# Altium schematic sheet MainBoard.SchDoc
size A3; SheetNumber: 2
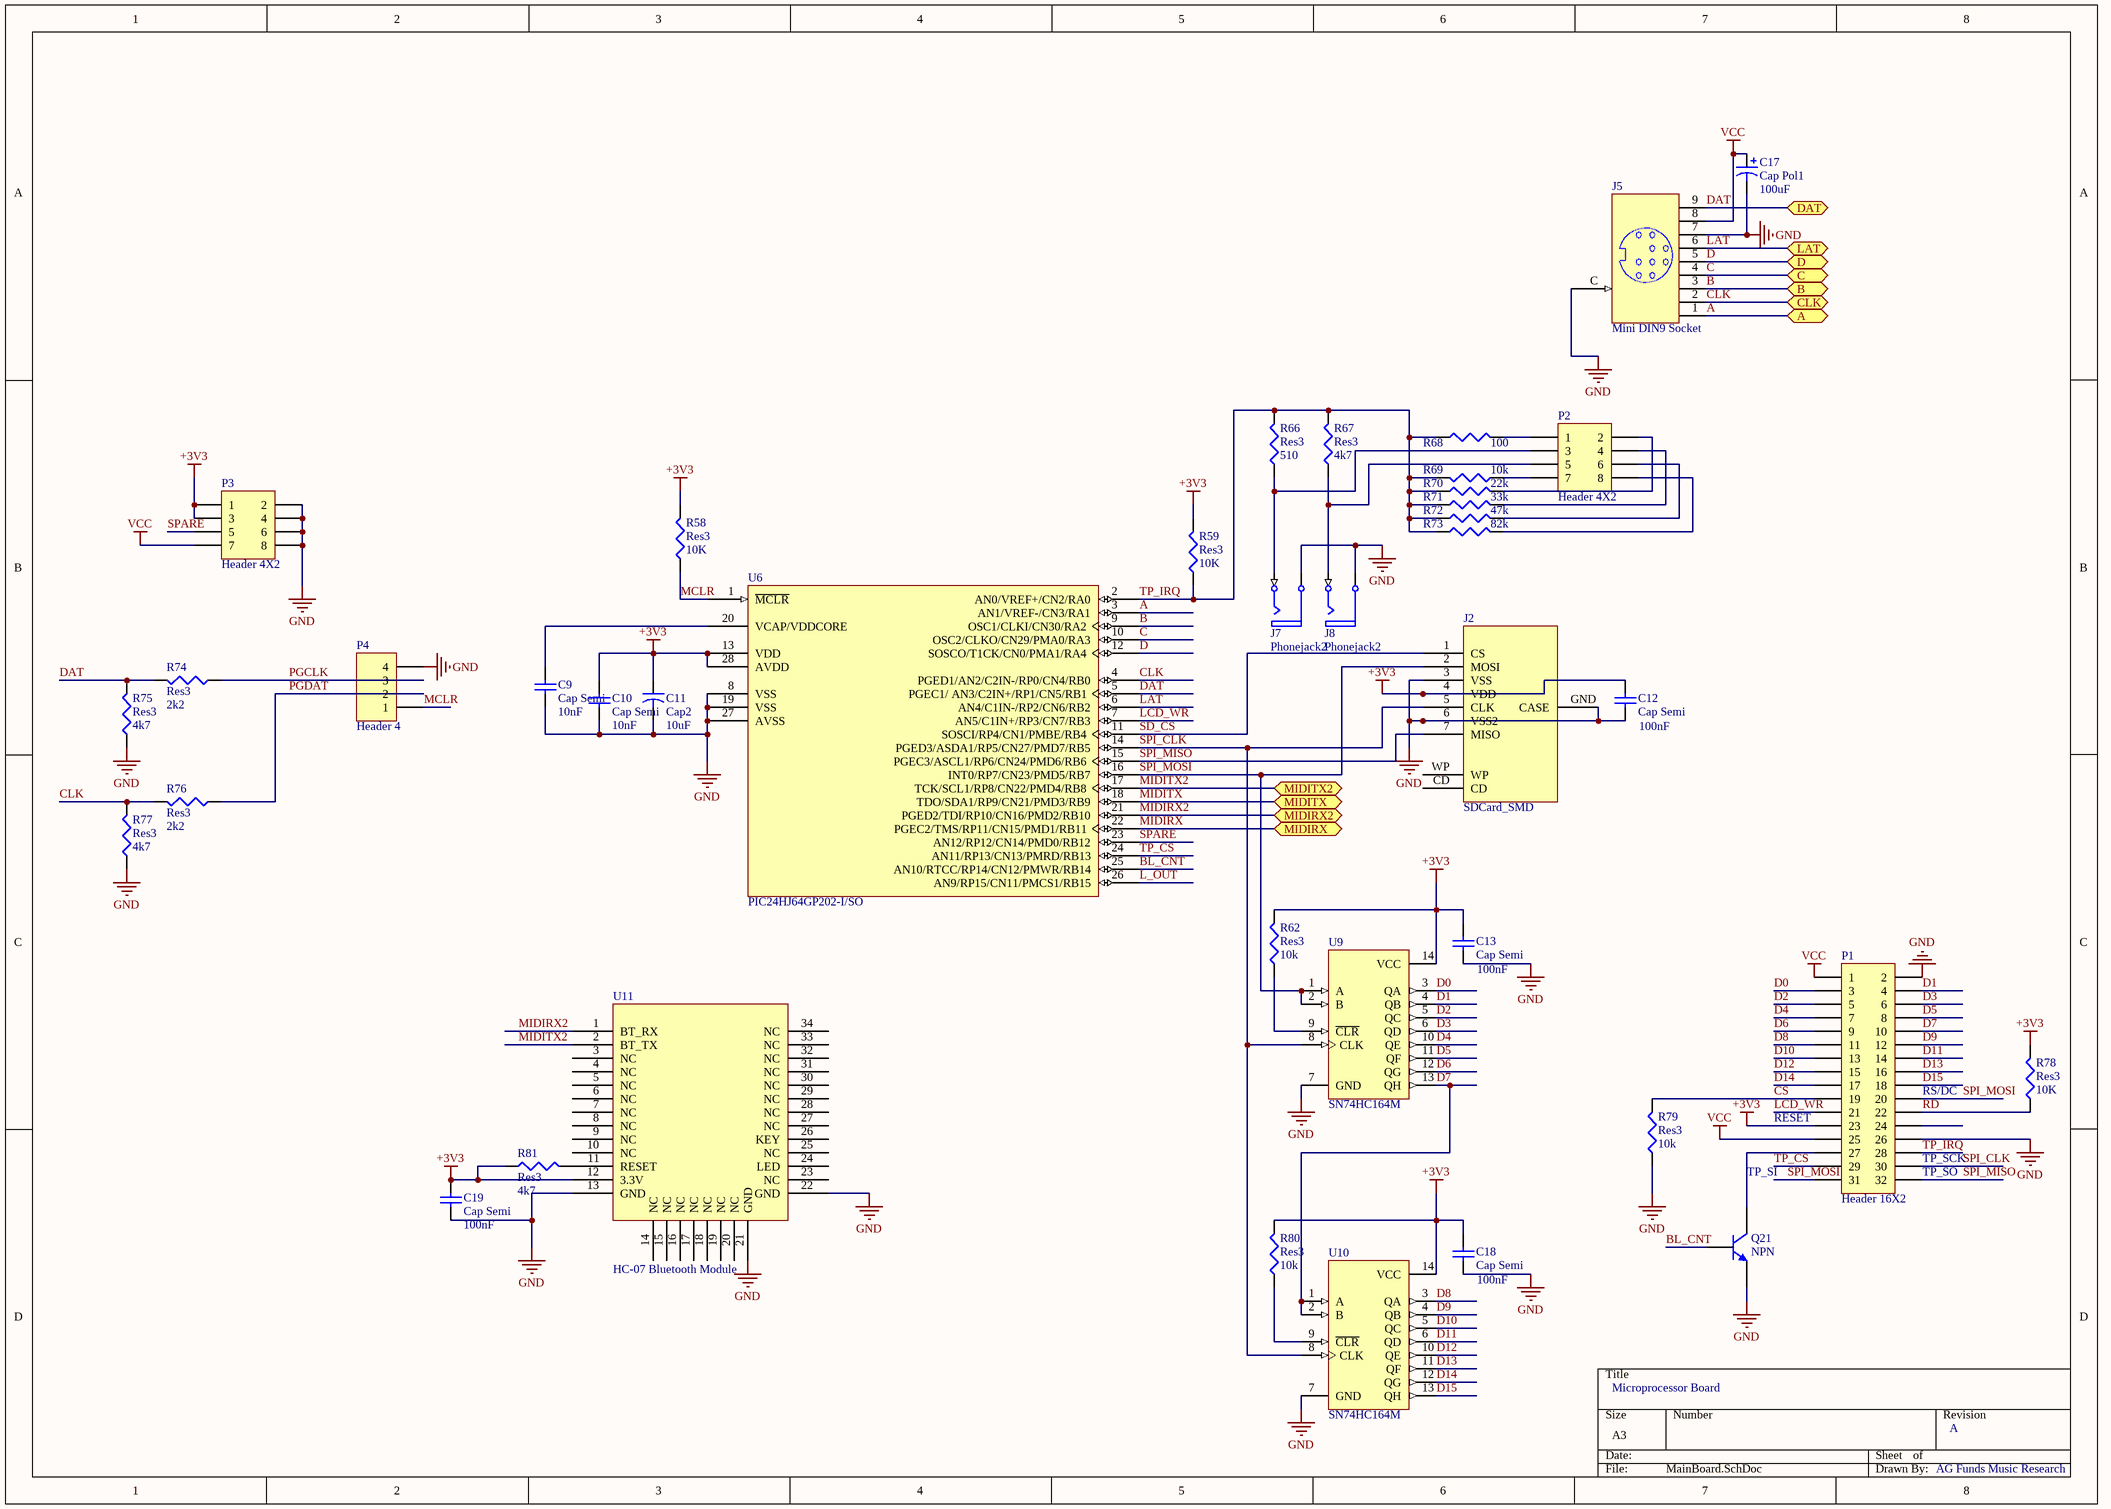
[diagram p0: MainBoard.SchDoc]

## Parts
C9  Cap Semi  value 10nF  [1608[0603]]
C10  Cap Semi  value 10nF  [1608[0603]]
C11  Cap2  value 10uF  [CAPR5-4X5]
C12  Cap Semi  value 100nF  [1608[0603]]
C13  Cap Semi  value 100nF  [1608[0603]]
C17  Cap Pol1  value 100uF  [RB7.6-15]
C18  Cap Semi  value 100nF  [1608[0603]]
C19  Cap Semi  value 100nF  [1608[0603]]
J2  SDCard_SMD  [SDCard]
J5  Mini DIN9 Socket  [9miniDIN]
J7  Phonejack2  [RN111PC]
J8  Phonejack2  [RN111PC]
P1  Header 16X2  [HDR2X16]
P2  Header 4X2  [HDR2X4]
P3  Header 4X2  [HDR2X4]
P4  Header 4  [HDR1X4]
Q21  NPN  [SOT95P230-3N]
R58  Res3  value 10K  [J1-0603]
R59  Res3  value 10K  [J1-0603]
R62  Res3  value 10k  [J1-0603]
R66  Res3  value 510  [J1-0603]
R67  Res3  value 4k7  [J1-0603]
R68  value 100  [J1-0603]  (hidden comment: Res3)
R69  value 10k  [J1-0603]  (hidden comment: Res3)
R70  value 22k  [J1-0603]  (hidden comment: Res3)
R71  value 33k  [J1-0603]  (hidden comment: Res3)
R72  value 47k  [J1-0603]  (hidden comment: Res3)
R73  value 82k  [J1-0603]  (hidden comment: Res3)
R74  Res3  value 2k2  [J1-0603]
R75  Res3  value 4k7  [J1-0603]
R76  Res3  value 2k2  [J1-0603]
R77  Res3  value 4k7  [J1-0603]
R78  Res3  value 10K  [J1-0603]
R79  Res3  value 10k  [J1-0603]
R80  Res3  value 10k  [J1-0603]
R81  Res3  value 4k7  [J1-0603]
U6  PIC24HJ64GP202-I/SO  [SOIC-SO28_N]
U9  SN74HC164M  [SOIC127P600-14AM]
U10  SN74HC164M  [SOIC127P600-14AM]
U11  HC-07 Bluetooth Module  [BTModule]

## Ports
A, B, C, CLK, D, DAT, LAT, MIDIRX, MIDIRX2, MIDITX, MIDITX2

## Nets
+3V3: C10.2 C11.1 C12.2 C13.2 C18.2 C19.2 J2.4(VDD) P1.23 P3.1 P3.3 R58.2 R59.2 R62.2 R78.2 R80.2 R81.1 U6.13(VDD) U6.28(AVDD) U9.14(VCC) U10.14(VCC) U11.12(3.3V)
GND: C9.1 C10.1 C11.2 C12.1 C13.1 C17.2 C18.1 C19.1 J2.3(VSS) J2.6(VSS2) J2.GND(CASE) J5.7 J5.C J7.SLEEVE(S) J8.SLEEVE(S) P1.2 P1.26 P3.2 P3.4 P3.6 P3.8 P4.4 Q21.3(E) R75.1 R77.1 R79.1 U6.8(VSS) U6.19(VSS) U6.27(AVSS) U9.7(GND) U10.7(GND) U11.13(GND) U11.21(GND) U11.22(GND)
VCC: C17.1 J5.8 P1.1 P1.25 P3.7
A: J5.1 U6.3(AN1/VREF-/CN3/RA1) ; port A
B: J5.3 U6.9(OSC1/CLKI/CN30/RA2) ; port B
BL_CNT: Q21.2(B) U6.25(AN10/RTCC/RP14/CN12/PMWR/RB14)
C: J5.4 U6.10(OSC2/CLKO/CN29/PMA0/RA3) ; port C
CLK: J5.2 R76.2 R77.2 U6.4(PGED1/AN2/C2IN-/RP0/CN4/RB0) ; port CLK
CS: P1.19 R79.2
D: J5.5 U6.12(SOSCO/T1CK/CN0/PMA1/RA4) ; port D
D0: P1.3 U9.3(QA)
D1: P1.4 U9.4(QB)
D2: P1.5 U9.5(QC)
D3: P1.6 U9.6(QD)
D4: P1.7 U9.10(QE)
D5: P1.8 U9.11(QF)
D6: P1.9 U9.12(QG)
D7: P1.10 U9.13(QH) U10.1(A) U10.2(B)
D8: P1.11 U10.3(QA)
D9: P1.12 U10.4(QB)
D10: P1.13 U10.5(QC)
D11: P1.14 U10.6(QD)
D12: P1.15 U10.10(QE)
D13: P1.16 U10.11(QF)
D14: P1.17 U10.12(QG)
D15: P1.18 U10.13(QH)
DAT: J5.9 R74.2 R75.2 U6.5(PGEC1/_AN3/C2IN+/RP1/CN5/RB1) ; port DAT
L_OUT: U6.26(AN9/RP15/CN11/PMCS1/RB15)
LAT: J5.6 U6.6(AN4/C1IN-/RP2/CN6/RB2) ; port LAT
LCD_WR: P1.21 U6.7(AN5/C1IN+/RP3/CN7/RB3)
MCLR: P4.1 R58.1 U6.1(~{MCLR})
MIDIRX: U6.22(PGEC2/TMS/RP11/CN15/PMD1/RB11) ; port MIDIRX
MIDIRX2: U6.21(PGED2/TDI/RP10/CN16/PMD2/RB10) U11.1(BT_RX) ; port MIDIRX2
MIDITX: U6.18(TDO/SDA1/RP9/CN21/PMD3/RB9) ; port MIDITX
MIDITX2: U6.17(TCK/SCL1/RP8/CN22/PMD4/RB8) U11.2(BT_TX) ; port MIDITX2
PGCLK: P4.3 R74.1
PGDAT: P4.2 R76.1
RD: P1.22 R78.1
SD_CS: J2.1(CS) U6.11(SOSCI/RP4/CN1/PMBE/RB4)
SPARE: P3.5 U6.23(AN12/RP12/CN14/PMD0/RB12)
SPI_CLK: J2.5(CLK) P1.30 U6.14(PGED3/ASDA1/RP5/CN27/PMD7/RB5) U9.8(CLK) U10.8(CLK)
SPI_MISO: J2.7(MISO) P1.32 U6.15(PGEC3/ASCL1/RP6/CN24/PMD6/RB6)
SPI_MOSI: J2.2(MOSI) P1.20 P1.31 U6.16(INT0/RP7/CN23/PMD5/RB7) U9.1(A) U9.2(B)
TP_CS: P1.29 U6.24(AN11/RP13/CN13/PMRD/RB13)
TP_IRQ: P1.28 R59.1 R66.2 R67.2 R68.1 R69.2 R70.1 R71.1 R72.1 R73.1 U6.2(AN0/VREF+/CN2/RA0)
NetC9_2: C9.2 U6.20(VCAP/VDDCORE)
NetJ7_TIP: J7.TIP(T) P2.3 R66.1
NetJ8_TIP: J8.TIP(T) P2.5 R67.1
NetP1_27: P1.27 Q21.1(C)
NetP2_1: P2.1 R68.2
NetP2_2: P2.2 R70.2
NetP2_4: P2.4 R71.2
NetP2_6: P2.6 R72.2
NetP2_7: P2.7 R69.1
NetP2_8: P2.8 R73.2
NetR62_1: R62.1 U9.9(~{CLR})
NetR80_1: R80.1 U10.9(~{CLR})
NetR81_2: R81.2 U11.11(RESET)

Not connected (* = marked no-connect by the designer): J2 CD WP; P1 24; U11 3(NC) 4(NC) 5(NC) 6(NC) 7(NC) 8(NC) 9(NC) 10(NC) 14(NC) 15(NC) 16(NC) 17(NC) 18(NC) 19(NC) 20(NC) 23(NC) 24(LED) 25(NC) 26(KEY) 27(NC) 28(NC) 29(NC) 30(NC) 31(NC) 32(NC) 33(NC) 34(NC)

## Notes on the sheet
- (near P1) RESET
- (near P1) RS/DC
- TP_SI
- (near P1) TP_SCK
- (near P1) TP_SO
- Microprocessor Board
- A
- AG Funds Music Research

## Library data of the parts
C9 C10 C12 C13 C18 C19 = Cap Semi: Capacitor (Semiconductor SIM Model); Published: 8-Jun-2000; LatestRevisionDate: 29-May-2009; LatestRevisionNote: IPC-7351 Footprint Added.; PackageReference: C1206; Publisher: Altium Limited; PackageDescription: Chip Capacitor
C11 = Cap2: Capacitor; Published: 23-Sep-2002; PackageReference: CAPR5-4X5; Publisher: Altium Limited; PackageDescription: Capacitor; 2 Leads
C17 = Cap Pol1: Polarized Capacitor (Radial); Published: 8-Jun-2000; LatestRevisionDate: 17-Jul-2002; LatestRevisionNote: Re-released for DXP Platform.; PackageReference: RB7.6-15; Publisher: Altium Limited; PackageDescription: Polarized Capacitor (Radial); 2 Leads
J2 = SDCard_SPI: (101-00313) SD-Card Socket Surface Mount Amphenol Shouhmin Industry
J5 = mDIN9: CUI Inc. MD-90S MINIDIN9 PCB Mount Socket; Published: 17-Dec-2003; Publisher: Altium Limited; ComponentLink1Description: Manufacturer Link; ComponentLink1URL: http://www.oupiin.com/prodindx.html#Headers
J7 J8 = Phonejack2: Switchcraft RN-111PC Jack Socket, 1/4" [6.5mm], Thru-Hole, 2-Conductor Open Circuit; PackageDocument: 2003; PCB_Layout: Complies with manufacturer's recommendation.; DrillAndSlotSize: Corresponds to nominal value.; LatestRevisionDate: 15-Jul-2004; LatestRevisionNote: Component Replaced.; DatasheetDocument: 2003; PackageReference: S1VS_SNS; Publisher: Altium Limited; ComponentLink1Description: Manufacturer Link; ComponentLink1URL: http://www.cliffuk.co.uk/
P1 = Header 16X2: Header, 16-Pin, Dual row; LatestRevisionDate: 17-Jul-2002; LatestRevisionNote: Re-released for DXP Platform.; Publisher: Altium Limited
P2 P3 = Header 4X2: Header, 4-Pin, Dual row; LatestRevisionDate: 17-Jul-2002; LatestRevisionNote: Re-released for DXP Platform.; Publisher: Altium Limited
P4 = Header 4: Header, 4-Pin; LatestRevisionDate: 17-Jul-2002; LatestRevisionNote: Re-released for DXP Platform.; Publisher: Altium Limited
Q21 = NPN: BC817/BC818 SMD NPN Bipolar Transistor; Published: 8-Jun-2000; LatestRevisionDate: 17-Jul-2002; LatestRevisionNote: Re-released for DXP Platform.; PackageReference: TO-226-AA; Publisher: Altium Limited; PackageDescription: TO, Flat Index; 3 In-Line, Axial Leads; Body Dia. 4.8mm; Leads 0.55 x 0.51 mm (max); Code_JEDEC: TO-226-AA
R58 R59 R62 R66-R81 = Res3: Resistor; Published: 8-Jun-2000; LatestRevisionDate: 29-May-2009; LatestRevisionNote: IPC-7351 Footprint Added.; PackageReference: J1-0603; Publisher: Altium Limited; PackageDescription: Chip Resistor
U6 = PIC24HJ64GP202-I/SO: High Speed General Purpose 16-Bit Flash Microcontroller, 64KB Flash, 8KB RAM, 28-Pin SOIC, Industrial Temperature; Published: 2-Dec-2009; DatasheetVersion: revD, Nov-2009; PackageVersion: revBB, Aug-2009; PackageReference: SOIC-SO28; Publisher: Altium Limited; PackageDescription: 28-Lead Plastic Small Outline (SO) - Wide 7.50mm Body [SOIC]; Supplier 1: Digi-Key; Supplier Part Number 1: PIC24HJ64GP202-I/SO-ND; Supplier 2: Farnell; Supplier Part Number 2: 1576892; Code_JEDEC: MS-013; ComponentLink1Description: Datasheet; ComponentLink1URL: http://ww1.microchip.com/downloads/en/DeviceDoc/70293D.pdf; ComponentLink2Description: Packaging Specification; ComponentLink2URL: http://www.microchip.com/stellent/groups/techpub_sg/documents/packagingspec/en012702.pdf; ComponentLink3Description: Microchip.com Home; ComponentLink3URL: http://www.microchip.com/
U9 U10 = SN74HC164M: 8-Bit Parallel-Out Serial Shift Register; Published: 8-Jun-2000; LatestRevisionDate: 04-Mar-2005; LatestRevisionNote: Stylized 3D Model Added.; DatasheetVersion: May-1997; PackageVersion: Oct-1995; PackageReference: N014; Publisher: Altium Limited; PackageDescription: DIP; 14 Leads; Row Spacing 7.62 mm; Pitch 2.54 mm; ComponentLink1Description: Manufacturer Link; ComponentLink1URL: http://www.ti.com/; ComponentLink2Description: Datasheet; ComponentLink2URL: http://www-s.ti.com/sc/ds/sn74hc164.pdf
U11 = BTModule